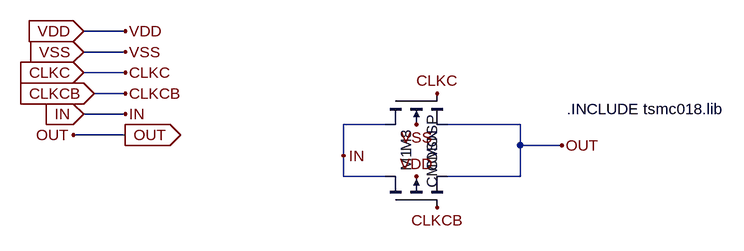
[diagram p0: schematic tm_gate_OUT.asc]
tm_gate_OUT.asc, the LTspice schematic file:
Version 4
SHEET 1 880 684
WIRE -128 176 -192 176
WIRE -128 208 -192 208
WIRE -128 240 -192 240
WIRE -128 272 -176 272
WIRE -128 304 -192 304
WIRE 272 320 208 320
WIRE 480 320 368 320
WIRE -128 336 -208 336
WIRE 480 352 480 320
WIRE 544 352 480 352
WIRE 208 368 208 320
WIRE 208 400 208 368
WIRE 272 400 208 400
WIRE 480 400 480 352
WIRE 480 400 368 400
FLAG 320 320 VSS
FLAG 320 400 VDD
FLAG -192 176 VDD
IOPIN -192 176 In
FLAG -192 208 VSS
IOPIN -192 208 In
FLAG -128 176 VDD
FLAG -128 208 VSS
FLAG 544 352 OUT
FLAG 208 368 IN
FLAG -192 304 IN
IOPIN -192 304 In
FLAG -128 304 IN
FLAG -128 336 OUT
IOPIN -128 336 Out
FLAG -208 336 OUT
FLAG -192 240 CLKC
IOPIN -192 240 In
FLAG -176 272 CLKCB
IOPIN -176 272 In
FLAG -128 240 CLKC
FLAG -128 272 CLKCB
FLAG 352 272 CLKC
FLAG 352 448 CLKCB
SYMBOL cmosp 272 448 R270
SYMATTR InstName M1
SYMATTR Value2 l=180n w=2u
SYMBOL cmosn 272 272 M90
SYMATTR InstName M8
SYMATTR Value2 l=180n w=1u
TEXT 552 296 Left 2 !.INCLUDE tsmc018.lib

The netlist it stands for:
* tm_gate_OUT.asc
M1 IN CLKCB OUT VDD CMOSP l=180n w=2u
M8 IN CLKC OUT VSS CMOSN l=180n w=1u
.model NMOS NMOS
.model PMOS PMOS
.lib standard.mos
.INCLUDE tsmc018.lib
.backanno
.end